# Altium schematic sheet Weight Gauge Schematic.SchDoc
size A4 portrait; Organization: Altium Limited; Address1: L3, 12a Rodborough Rd; Address2: Frenchs Forest; Address3: NSW; Address4: Australia 2086
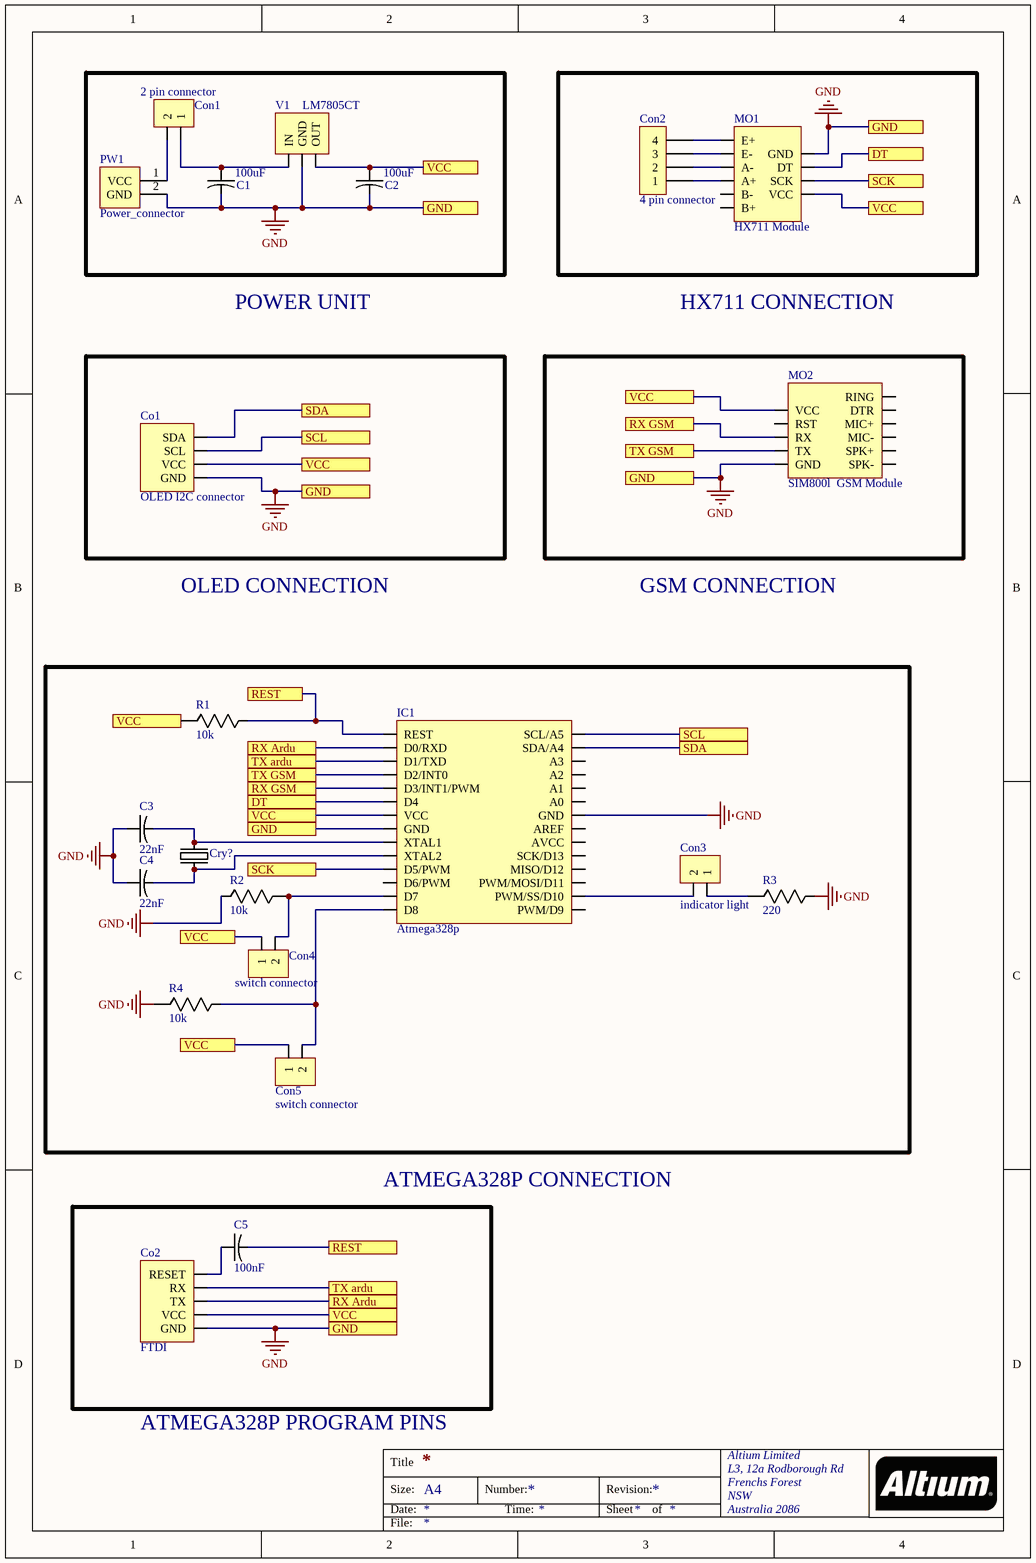
[diagram p0: Weight Gauge Schematic.SchDoc]

## Parts
C1  100uF  [100uF Capacitor]
C2  100uF  [100uF Capacitor]
C3  22nF  [22nF capacitor]
C4  22nF  [22nF capacitor]
C5  100nF  [22nF capacitor]
Co1  OLED I2C connector  [oled connector i2c]
Co2  FTDI  [FTDI]
Con1  2 pin connector  [2 pin  connector]
Con2  4 pin connector  [4 pin connector]
Con3  indicator light  [2 pin  connector]
Con4  switch connector  [2 pin  connector]
Con5  switch connector  [2 pin  connector]
Cry?  16mhz  [16mhz crystal]  (value not drawn)
IC1  Atmega328p  [Atmega328 TH]
MO1  HX711 Module  [HX711 MODULE]
MO2  SIM800l  GSM Module  [sim800l module]
PW1  Power_connector  [Power_connector]
R1  10k  [Resistor Vertical]
R2  10k  [Resistor Vertical]
R3  220  [Resistor Vertical]
R4  10k  [Resistor Vertical]
V1  LM7805CT  [LM7805CT]

## Blocks framed on the sheet
ATMEGA328P CONNECTION: C5 Co2

## Ports
DT, GND, REST, RX Ardu, RX GSM, SCK, SCL, SDA, TX ardu, TX GSM, VCC

## Nets
GND: C1.2(-) C2.2(-) C3.1(+) C4.1(+) Co1.1(GND) Co2.1(GND) IC1.8(GND) IC1.22(GND) MO1.7(GND) MO2.5(GND) PW1.2(GND) R2.2 R3.2 R4.1 V1.2(GND) ; port GND
DT: IC1.6(D4) MO1.8(DT) ; port DT
REST: C5.2(-) IC1.1(REST) R1.2 ; port REST
RX Ardu: Co2.3(TX) IC1.2(D0/RXD) ; port RX Ardu
RX GSM: IC1.5(D3/INT1/PWM) MO2.3(RX) ; port RX GSM
SCK: IC1.11(D5/PWM) MO1.9(SCK) ; port SCK
SCL: Co1.3(SCL) IC1.28(SCL/A5) ; port SCL
SDA: Co1.4(SDA) IC1.27(SDA/A4) ; port SDA
TX ardu: Co2.4(RX) IC1.3(D1/TXD) ; port TX ardu
TX GSM: IC1.4(D2/INT0) MO2.4(TX) ; port TX GSM
VCC: C2.1(+) Co1.2(VCC) Co2.2(VCC) Con4.1 Con5.1 IC1.7(VCC) MO1.10(VCC) MO2.1(VCC) R1.1 V1.3(OUT) ; port VCC
NetC1_1: C1.1(+) Con1.1 V1.1(IN)
NetC3_2: C3.2(-) Cry?.2 IC1.9(XTAL1)
NetC4_2: C4.2(-) Cry?.1 IC1.10(XTAL2)
NetC5_1: C5.1(+) Co2.5(RESET)
NetCon1_2: Con1.2 PW1.1(VCC)
NetCon2_1: Con2.1 MO1.4(A+)
NetCon2_2: Con2.2 MO1.3(A-)
NetCon2_3: Con2.3 MO1.2(E-)
NetCon2_4: Con2.4 MO1.1(E+)
NetCon3_1: Con3.1 R3.1
NetCon3_2: Con3.2 IC1.16(PWM/SS/D10)
NetCon4_2: Con4.2 IC1.13(D7) R2.1
NetCon5_2: Con5.2 IC1.14(D8) R4.2

Not connected (* = marked no-connect by the designer): IC1 12(D6/PWM) 15(PWM/D9) 17(PWM/MOSI/D11) 18(MISO/D12) 19(SCK/D13) 20(AVCC) 21(AREF) 23(A0) 24(A1) 25(A2) 26(A3); MO1 5(B-) 6(B+); MO2 2(RST) 6(SPK-) 7(SPK+) 8(MIC-) 9(MIC+) 10(DTR) 11(RING)

## Notes on the sheet
- POWER UNIT
- HX711 CONNECTION
- OLED CONNECTION
- GSM CONNECTION
- ATMEGA328P PROGRAM PINS
- Title
- Size:
- Date:
- A4
- Number:
- Time:
- Revision:
- Sheet
- of
- File:

## Library data of the parts
C1 C2 = 100uF Capacitor
C3-C5 = 22nF Capacitor
Con3-Con5 = 2 pin connector
Cry? = 16mhz crystal
R1-R4 = Resistor vertical